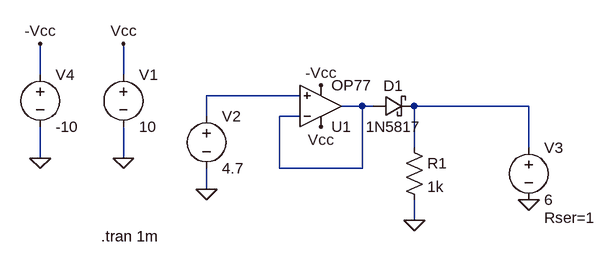
[diagram p0: schematic Draft9.asc]
Draft9.asc, the LTspice schematic file:
Version 4
SHEET 1 880 680
WIRE -224 -16 -224 -64
WIRE -96 -16 -96 -64
WIRE 176 16 32 16
WIRE 272 32 240 32
WIRE 288 32 272 32
WIRE 528 32 352 32
WIRE 32 48 32 16
WIRE 176 48 144 48
WIRE 352 96 352 32
WIRE 528 96 528 32
WIRE -224 112 -224 64
WIRE -96 112 -96 64
WIRE 144 128 144 48
WIRE 272 128 272 32
WIRE 272 128 144 128
WIRE 32 160 32 128
WIRE 352 208 352 176
FLAG -96 112 0
FLAG -96 -64 Vcc
FLAG 208 64 Vcc
FLAG 352 208 0
FLAG 32 160 0
FLAG 528 176 0
FLAG -224 112 0
FLAG -224 -64 -Vcc
FLAG 208 0 -Vcc
SYMBOL OpAmps\\OP77 208 96 M180
SYMATTR InstName U1
SYMBOL voltage -96 -32 R0
WINDOW 123 0 0 Left 0
WINDOW 39 0 0 Left 0
SYMATTR InstName V1
SYMATTR Value 10
SYMBOL res 336 80 R0
SYMATTR InstName R1
SYMATTR Value 1k
SYMBOL voltage 32 32 R0
WINDOW 123 0 0 Left 0
WINDOW 39 0 0 Left 0
SYMATTR InstName V2
SYMATTR Value 4.7
SYMBOL schottky 288 48 R270
WINDOW 0 32 32 VTop 2
WINDOW 3 0 32 VBottom 2
SYMATTR InstName D1
SYMATTR Value 1N5817
SYMATTR Description Diode
SYMATTR Type diode
SYMBOL voltage 528 80 R0
WINDOW 123 0 0 Left 0
WINDOW 39 24 124 Left 2
SYMATTR InstName V3
SYMATTR Value 6
SYMATTR SpiceLine Rser=1
SYMBOL voltage -224 -32 R0
WINDOW 123 0 0 Left 0
WINDOW 39 0 0 Left 0
SYMATTR InstName V4
SYMATTR Value -10
TEXT -130 232 Left 2 !.tran 1m

The netlist it stands for:
* Draft9.asc
XU1 N001 N002 Vcc -Vcc N002 OP77  ; pins In+ In- V+ V- OUT
V1 Vcc 0 10
R1 N003 0 1k
V2 N001 0 4.7
D1 N002 N003 1N5817
V3 N003 0 6 Rser=1
V4 -Vcc 0 -10
.model D D
.lib standard.dio
.tran 1m
.lib ADI.lib
.backanno
.end